# Altium schematic sheet PM12_ATxmega128.SchDoc: FIT_PM12 board
size 420 x 297 mm; CheckedBy: G.Kasprowicz; Author: INR Moscow; CompanyName: WUT ISE; DrawnBy: M.Podgórski; Organization: WUT ISE; Address1: PW ISE; Address2: Nowowiejska 15/19 00-665 Warsaw; Address3: gkasprow@gmail.com; DocumentNumber: 21; Revision: 2; SheetNumber: 5; SheetTotal: 34; ModifiedBy: -; CheckedDate: -; Title2: MCU; DivGrp: WUT ISE; Designer: INR RAS; ModifiedDate: -; ProjectName: Sensor Box
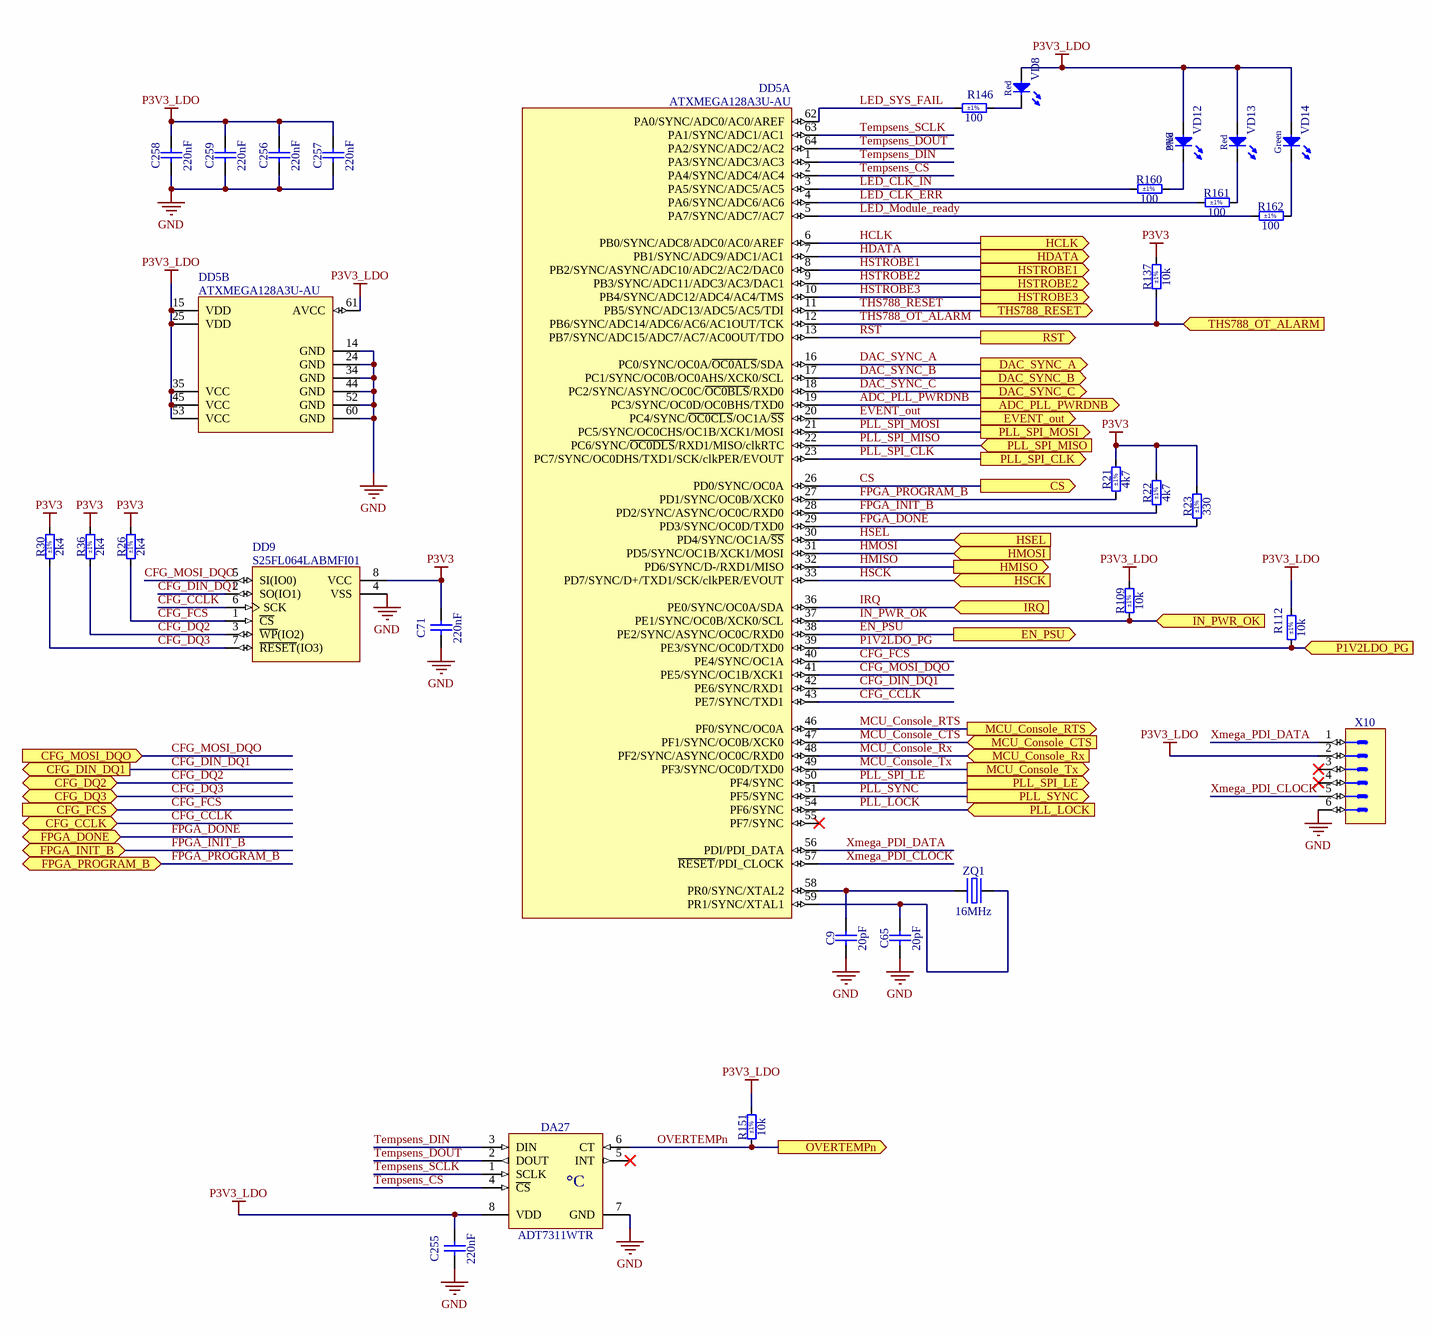
[diagram p0: PM12_ATxmega128.SchDoc]

## Parts
C9  20pF  [CAPC2012X135N]
C65  20pF  [CAPC2012X135N]
C71  220nF  [CAPC2012X135N]
C255  220nF  [CAPC2012X135N]
C256  220nF  [CAPC2012X135N]
C257  220nF  [CAPC2012X135N]
C258  220nF  [CAPC2012X135N]
C259  220nF  [CAPC2012X135N]
DA27  ADT7311WTR  [SOIC127P600X175-8N]
DD5  ATXMEGA128A3U-AU  [QFP80P1600X1600X120-64N]  (parts A,B of 2)
DD9  S25FL064LABMFI01  [SOIC127P800X216-8N]
R21  4k7  Tolerance: ±1%  [RESC2012X60N]
R22  4k7  Tolerance: ±1%  [RESC2012X60N]
R23  330  Tolerance: ±1%  [RESC2012X60N]
R26  2k4  Tolerance: ±1%  [RESC2012X60N]
R30  2k4  Tolerance: ±1%  [RESC2012X60N]
R36  2k4  Tolerance: ±1%  [RESC2012X60N]
R109  10k  Tolerance: ±1%  [RESC2012X60N]
R112  10k  Tolerance: ±1%  [RESC2012X60N]
R137  10k  Tolerance: ±1%  [RESC2012X60N]
R146  100  Tolerance: ±1%  [RESC2012X60N]
R151  10k  Tolerance: ±1%  [RESC2012X60N]
R160  100  Tolerance: ±1%  [RESC2012X60N]
R161  100  Tolerance: ±1%  [RESC2012X60N]
R162  100  Tolerance: ±1%  [RESC2012X60N]
VD8  Red  [LED_KINGBRIGHT_KPT-2012SURCK]
VD12  Blue  [LED_KINGBRIGHT_KPT-2012VBC-D]
VD13  Red  [LED_KINGBRIGHT_KPT-2012SURCK]
VD14  Green  [LED_KINGBRIGHT_KP-2012LSGC]
X10  (no value)  [CONNFLY_DS1013-06SSIB1-B-0]
ZQ1  16MHz  [XTAL_ABRACON_ABL]

## Ports
ADC_PLL_PWRDNB (out), CFG_CCLK (bidir), CFG_DIN_DQ1 (out), CFG_DQ2 (bidir), CFG_DQ3 (bidir), CFG_FCS (in), CFG_MOSI_DQO (in), CS (out), DAC_SYNC_A (out), DAC_SYNC_B (out), DAC_SYNC_C (out), EN_PSU (out), EVENT_out (out), FPGA_DONE (bidir), FPGA_INIT_B (bidir), FPGA_PROGRAM_B (bidir), HCLK (out), HDATA (out), HMISO (out), HMOSI (in), HSCK (in), HSEL (in), HSTROBE1 (out), HSTROBE2 (out), HSTROBE3 (out), IN_PWR_OK (in), IRQ (in), MCU_Console_CTS (in), MCU_Console_RTS (out), MCU_Console_Rx (in), MCU_Console_Tx (out), OVERTEMPn (out), P1V2LDO_PG (in), PLL_LOCK (in), PLL_SPI_CLK (out), PLL_SPI_LE (out), PLL_SPI_MISO (in), PLL_SPI_MOSI (out), PLL_SYNC (out), RST (out), THS788_OT_ALARM (in), THS788_RESET (out)

## Nets
GND: C9.1 C65.1 C71.1 C255.1 C256.1 C257.1 C258.1 C259.1 DA27.7(GND) DD5.14(GND) DD5.24(GND) DD5.34(GND) DD5.44(GND) DD5.52(GND) DD5.60(GND) DD9.4(VSS) X10.6
P3V3: C71.2 DD9.8(VCC) R21.2 R22.2 R23.2 R26.2 R30.2 R36.2 R137.2
P3V3_LDO: C255.2 C256.2 C257.2 C258.2 C259.2 DA27.8(VDD) DD5.15(VDD) DD5.25(VDD) DD5.35(VCC) DD5.45(VCC) DD5.53(VCC) DD5.61(AVCC) R109.2 R112.2 R151.2 VD8.2(A) VD12.2(A) VD13.2(A) VD14.2(A) X10.2
ADC_PLL_PWRDNB: DD5.19(PC3/SYNC/OC0D/OC0BHS/TXD0) ; port ADC_PLL_PWRDNB
CFG_CCLK: DD5.43(PE7/SYNC/TXD1) DD9.6(SCK) ; port CFG_CCLK
CFG_DIN_DQ1: DD5.42(PE6/SYNC/RXD1) DD9.2(SO(IO1)) ; port CFG_DIN_DQ1
CFG_DQ2: DD9.3(~{WP}(IO2)) R36.1 ; port CFG_DQ2
CFG_DQ3: DD9.7(~{RESET}(IO3)) R30.1 ; port CFG_DQ3
CFG_FCS: DD5.40(PE4/SYNC/OC1A) DD9.1(~{CS}) R26.1 ; port CFG_FCS
CFG_MOSI_DQO: DD5.41(PE5/SYNC/OC1B/XCK1) DD9.5(SI(IO0)) ; port CFG_MOSI_DQO
CS: DD5.26(PD0/SYNC/OC0A) ; port CS
DAC_SYNC_A: DD5.16(PC0/SYNC/OC0A/~{OC0ALS}/SDA) ; port DAC_SYNC_A
DAC_SYNC_B: DD5.17(PC1/SYNC/OC0B/OC0AHS/XCK0/SCL) ; port DAC_SYNC_B
DAC_SYNC_C: DD5.18(PC2/SYNC/ASYNC/OC0C/~{OC0BLS}/RXD0) ; port DAC_SYNC_C
EN_PSU: DD5.38(PE2/SYNC/ASYNC/OC0C/RXD0) ; port EN_PSU
EVENT_out: DD5.20(PC4/SYNC/~{OC0CLS}/OC1A/~{SS}) ; port EVENT_out
FPGA_DONE: DD5.29(PD3/SYNC/OC0D/TXD0) R23.1 ; port FPGA_DONE
FPGA_INIT_B: DD5.28(PD2/SYNC/ASYNC/OC0C/RXD0) R22.1 ; port FPGA_INIT_B
FPGA_PROGRAM_B: DD5.27(PD1/SYNC/OC0B/XCK0) R21.1 ; port FPGA_PROGRAM_B
HCLK: DD5.6(PB0/SYNC/ADC8/ADC0/AC0/AREF) ; port HCLK
HDATA: DD5.7(PB1/SYNC/ADC9/ADC1/AC1) ; port HDATA
HMISO: DD5.32(PD6/SYNC/D-/RXD1/MISO) ; port HMISO
HMOSI: DD5.31(PD5/SYNC/OC1B/XCK1/MOSI) ; port HMOSI
HSCK: DD5.33(PD7/SYNC/D+/TXD1/SCK/clkPER/EVOUT) ; port HSCK
HSEL: DD5.30(PD4/SYNC/OC1A/~{SS}) ; port HSEL
HSTROBE1: DD5.8(PB2/SYNC/ASYNC/ADC10/ADC2/AC2/DAC0) ; port HSTROBE1
HSTROBE2: DD5.9(PB3/SYNC/ADC11/ADC3/AC3/DAC1) ; port HSTROBE2
HSTROBE3: DD5.10(PB4/SYNC/ADC12/ADC4/AC4/TMS) ; port HSTROBE3
IN_PWR_OK: DD5.37(PE1/SYNC/OC0B/XCK0/SCL) R109.1 ; port IN_PWR_OK
IRQ: DD5.36(PE0/SYNC/OC0A/SDA) ; port IRQ
LED_CLK_ERR: DD5.4(PA6/SYNC/ADC6/AC6) R161.1
LED_CLK_IN: DD5.3(PA5/SYNC/ADC5/AC5) R160.1
LED_Module_ready: DD5.5(PA7/SYNC/ADC7/AC7) R162.1
LED_SYS_FAIL: DD5.62(PA0/SYNC/ADC0/AC0/AREF) R146.1
MCU_Console_CTS: DD5.47(PF1/SYNC/OC0B/XCK0) ; port MCU_Console_CTS
MCU_Console_RTS: DD5.46(PF0/SYNC/OC0A) ; port MCU_Console_RTS
MCU_Console_Rx: DD5.48(PF2/SYNC/ASYNC/OC0C/RXD0) ; port MCU_Console_Rx
MCU_Console_Tx: DD5.49(PF3/SYNC/OC0D/TXD0) ; port MCU_Console_Tx
OVERTEMPn: DA27.6(CT) R151.1 ; port OVERTEMPn
P1V2LDO_PG: DD5.39(PE3/SYNC/OC0D/TXD0) R112.1 ; port P1V2LDO_PG
PLL_LOCK: DD5.54(PF6/SYNC) ; port PLL_LOCK
PLL_SPI_CLK: DD5.23(PC7/SYNC/OC0DHS/TXD1/SCK/clkPER/EVOUT) ; port PLL_SPI_CLK
PLL_SPI_LE: DD5.50(PF4/SYNC) ; port PLL_SPI_LE
PLL_SPI_MISO: DD5.22(PC6/SYNC/~{OC0DLS}/RXD1/MISO/clkRTC) ; port PLL_SPI_MISO
PLL_SPI_MOSI: DD5.21(PC5/SYNC/OC0CHS/OC1B/XCK1/MOSI) ; port PLL_SPI_MOSI
PLL_SYNC: DD5.51(PF5/SYNC) ; port PLL_SYNC
RST: DD5.13(PB7/SYNC/ADC15/ADC7/AC7/AC0OUT/TDO) ; port RST
Tempsens_CS: DA27.4(~{CS}) DD5.2(PA4/SYNC/ADC4/AC4)
Tempsens_DIN: DA27.3(DIN) DD5.1(PA3/SYNC/ADC3/AC3)
Tempsens_DOUT: DA27.2(DOUT) DD5.64(PA2/SYNC/ADC2/AC2)
Tempsens_SCLK: DA27.1(SCLK) DD5.63(PA1/SYNC/ADC1/AC1)
THS788_OT_ALARM: DD5.12(PB6/SYNC/ADC14/ADC6/AC6/AC1OUT/TCK) R137.1 ; port THS788_OT_ALARM
THS788_RESET: DD5.11(PB5/SYNC/ADC13/ADC5/AC5/TDI) ; port THS788_RESET
Xmega_PDI_CLOCK: DD5.57(~{RESET}/PDI_CLOCK) X10.5
Xmega_PDI_DATA: DD5.56(PDI/PDI_DATA) X10.1
NetC9_2: C9.2 DD5.58(PR0/SYNC/XTAL2) ZQ1.1(OSC1)
NetC65_2: C65.2 DD5.59(PR1/SYNC/XTAL1) ZQ1.2(OSC2)
NetR146_2: R146.2 VD8.1(C)
NetR160_2: R160.2 VD12.1(C)
NetR161_2: R161.2 VD13.1(C)
NetR162_2: R162.2 VD14.1(C)

Not connected (* = marked no-connect by the designer): DA27 5(INT)*; DD5 55(PF7/SYNC)*; X10 3* 4*

## Notes on the sheet
- Project/Equipment
- Document
- Designer
- Drawn by
- Check.by
- Copyright WUT ISE 2024.
  This documentation describes Open Hardware and is licensed under the CERN OHL v.2. You may redistribute and modify this documentation under the terms of the CERN OHL v.2. (http://ohwr.org/CERNOHL). This documentation is distributed WITHOUT ANY EXPRESS OR IMPLIED WARRANTY, INCLUDING OF MERCHANTABILITY, SATISFACTORY QUALITY AND FITNESS FOR A PARTICULAR PURPOSE. Please see the CERN OHL v.2 for applicable conditions.
- Contact
- File
- Last Mod.
- Print Date
- Sheet
- Size
- A3
- of
- Rev
- (in symbol ADT7311WTR) °C

## Library data of the parts
C9 C65 = CC0805_20PF_50V_2%_C0G: Non-polarised capacitor; Part Description: SMD Multilayer Chip Ceramic Capacitor; Manufacturer: GENERIC; Manufacturer1 Part Number: CC0805GRNPO9BN200; Voltage: 50V; TC: C0G/NP0; Tolerance: ±2%; Part Number: CC0805_20PF_50V_2%_C0G; Component Kind: Standard; Component Type: Standard; Pin Count: 2; Value: 20pF; Status: None; Manufacturer Part Number: CC0805_20PF_50V_2%_C0G; Case: 0805; Mounted: Yes; Socket: No; SMD: Yes; Sense: No; Manufacturer1 Example: YAGEO PHYCOMP; Manufacturer1 ComponentHeight: 1.45mm; HelpURL: \\cern.ch\dfs\Applications\Altium\Datasheets\CC0805_NP0_YAGEO.pdf; Author: CERN DEM HF; CreateDate: 07.05.2024; LatestRevisionDate: 07.05.2024
C71 C255-C259 = CC0805_220NF_50V_10%_X7R: Non-polarised capacitor; Part Description: SMD Multilayer Chip Ceramic Capacitor; Manufacturer: GENERIC; Manufacturer1 Part Number: GRM21BR71H224KA01L; Voltage: 50V; TC: X7R; Tolerance: ±10%; Part Number: CC0805_220NF_50V_10%_X7R; Component Kind: Standard; Component Type: Standard; Pin Count: 2; Value: 220nF; Status: Preferred; Manufacturer Part Number: CC0805_220NF_50V_10%_X7R; Case: 0805; Mounted: Yes; Socket: No; SMD: Yes; Sense: No; Manufacturer1 Example: MURATA; Manufacturer1 ComponentHeight: 1.35mm; HelpURL: \\cern.ch\dfs\Applications\Altium\Datasheets\CC0805_X7R_MURATA.pdf; Author: CERN DEM JLC; CreateDate: 03.12.2007; LatestRevisionDate: 03.12.2007
DA27 = ADT7311WTR: ±0.5°C Accurate, 16-Bit Digital SPI Temperature Sensor; Manufacturer: ANALOG DEVICES; PressFit: No; Bonding: No; Part Number: ADT7311WTR; Component Kind: Standard; Component Type: Standard; Device: ADT7311WTR; PackageDescription: SOIC 8, Pitch 1.27mm - Body 4x5mm, IPC Medium Density; Part Description: ±0.5°C Accurate, 16-Bit Digital SPI Temperature Sensor; Manufacturer Part Number: ADT7311WTR; Pin Count: 8; Case: SOIC8; Mounted: Yes; Socket: No; SMD: Yes; Sense: No; ComponentHeight: 1.75mm; HelpURL: \\cern.ch\dfs\Applications\Altium\Datasheets\ADT7311WTR.pdf; Author: CERN DEM HF; CreateDate: 24.05.2024; LatestRevisionDate: 24.05.2024
DD5 = ATXMEGA128A3U-AU: 8/16-bit XMEGA A3BU 32MHz Microcontroller With 256KBytes of in-System Self-Programmable Flash; Part Description: 8/16-bit XMEGA A3U 32MHz Microcontroller with 128KBytes of in-System Self-Programmable Flash; Manufacturer: MICROCHIP TECHNOLOGY; PressFit: No; Bonding: No; Part Number: ATXMEGA128A3U-AU; Component Kind: Standard; Component Type: Standard; Device: ATXMEGA128A3U-AU; PackageDescription: QFP, 0.80mm Pitch, Square; 64 Pin, 14.00mm L X 14.00mm W X 1.20mm H body, IPC Medium Density; Manufacturer Part Number: ATXMEGA128A3U-AU; Pin Count: 64; Case: QFP64; Mounted: Yes; Socket: No; SMD: Yes; Sense: No; ComponentHeight: 1.2mm; HelpURL: \\cern.ch\dfs\Applications\Altium\Datasheets\ATXMEGA128A3U-AU.pdf; Author: CERN DEM HF; CreateDate: 24.05.2024; LatestRevisionDate: 24.05.2024
DD9 = S25FL064LABMFI01: 64 Mb (8 MB), 3V, FL-L SPI Flash Memory; Manufacturer: INFINEON; PressFit: No; Bonding: No; Part Number: S25FL064LABMFI01; Component Kind: Standard; Component Type: Standard; Device: S25FL064LABMFI01; PackageDescription: SOIC, 1.27mm Pitch; 8 Pin, 5.28mm W X 5.28mm L X 2.16mm H body, IPC Medium Density; Part Description: 64 Mb (8 MB), 3V, FL-L SPI Flash Memory; Manufacturer Part Number: S25FL064LABMFI01; Pin Count: 8; Case: SOIC8; Mounted: Yes; Socket: No; SMD: Yes; Sense: No; ComponentHeight: 2.16mm; HelpURL: \\cern.ch\dfs\Applications\Altium\Datasheets\S25FL064L.pdf; Author: CERN DEM HF; CreateDate: 06.06.2024; LatestRevisionDate: 06.06.2024
R21 R22 = R0805_4K7_1%_0.125W_100PPM: Resistor - 1%; Part Description: General Purpose Thick Film Chip Resistor; Manufacturer: GENERIC; Manufacturer1 Part Number: NRC10F4701TRF; Power: 0.125W; TC: ±100ppm/°C; PressFit: No; Part Number: R0805_4K7_1%_0.125W_100PPM; Component Kind: Standard; Component Type: Standard; Pin Count: 2; Value: 4k7; Status: Preferred; Manufacturer Part Number: R0805_4K7_1%_0.125W_100PPM; Case: 0805; Mounted: Yes; Sense: No; Socket: No; SMD: Yes; Manufacturer1 Example: NIC COMPONENT; Manufacturer1 ComponentHeight: 0.6mm; HelpURL: \\cern.ch\dfs\Applications\Altium\Datasheets\R0805_NIC_NRC.pdf; Author: CERN DEM JLC; CreateDate: 03.12.2007; LatestRevisionDate: 13.03.2008
R23 = R0805_330R_1%_0.125W_100PPM: Resistor - 1%; Part Description: General Purpose Thick Film Chip Resistor; Manufacturer: GENERIC; Manufacturer1 Part Number: NRC10F3300TRF; Power: 0.125W; TC: ±100ppm/°C; PressFit: No; Part Number: R0805_330R_1%_0.125W_100PPM; Component Kind: Standard; Component Type: Standard; Pin Count: 2; Value: 330; Status: Preferred; Manufacturer Part Number: R0805_330R_1%_0.125W_100PPM; Case: 0805; Mounted: Yes; Sense: No; Socket: No; SMD: Yes; Manufacturer1 Example: NIC COMPONENT; Manufacturer1 ComponentHeight: 0.6mm; HelpURL: \\cern.ch\dfs\Applications\Altium\Datasheets\R0805_NIC_NRC.pdf; Author: CERN DEM JLC; CreateDate: 03.12.2007; LatestRevisionDate: 13.03.2008
R26 R30 R36 = R0805_2K4_1%_0.125W_100PPM: Resistor - 1%; Part Description: General Purpose Thick Film Chip Resistor; Manufacturer: GENERIC; Manufacturer1 Part Number: NRC10F2401TRF; Power: 0.125W; TC: ±100ppm/°C; PressFit: No; Part Number: R0805_2K4_1%_0.125W_100PPM; Component Kind: Standard; Component Type: Standard; Pin Count: 2; Value: 2k4; Status: Preferred; Manufacturer Part Number: R0805_2K4_1%_0.125W_100PPM; Case: 0805; Mounted: Yes; Sense: No; Socket: No; SMD: Yes; Manufacturer1 Example: NIC COMPONENT; Manufacturer1 ComponentHeight: 0.6mm; HelpURL: \\cern.ch\dfs\Applications\Altium\Datasheets\R0805_NIC_NRC.pdf; Author: CERN DEM JLC; CreateDate: 03.12.2007; LatestRevisionDate: 13.03.2008
R109 R112 R137 R151 = R0805_10K_1%_0.125W_100PPM: Resistor - 1%; Part Description: General Purpose Thick Film Chip Resistor; Manufacturer: GENERIC; Manufacturer1 Part Number: NRC10F1002TRF; Power: 0.125W; TC: ±100ppm/°C; PressFit: No; Part Number: R0805_10K_1%_0.125W_100PPM; Component Kind: Standard; Component Type: Standard; Pin Count: 2; Value: 10k; Status: Preferred; Manufacturer Part Number: R0805_10K_1%_0.125W_100PPM; Case: 0805; Mounted: Yes; Sense: No; Socket: No; SMD: Yes; Manufacturer1 Example: NIC COMPONENT; Manufacturer1 ComponentHeight: 0.6mm; HelpURL: \\cern.ch\dfs\Applications\Altium\Datasheets\R0805_NIC_NRC.pdf; Author: CERN DEM JLC; CreateDate: 03.12.2007; LatestRevisionDate: 13.03.2008
R146 R160-R162 = R0805_100R_1%_0.125W_100PPM: Resistor - 1%; Part Description: General Purpose Thick Film Chip Resistor; Manufacturer: GENERIC; Manufacturer1 Part Number: NRC10F4700TRF; Power: 0.125W; TC: ±100ppm/°C; PressFit: No; Part Number: R0805_100R_1%_0.125W_100PPM; Component Kind: Standard; Component Type: Standard; Pin Count: 2; Value: 100; Status: Preferred; Manufacturer Part Number: R0805_100R_1%_0.125W_100PPM; Case: 0805; Mounted: Yes; Sense: No; Socket: No; SMD: Yes; Manufacturer1 Example: NIC COMPONENT; Manufacturer1 ComponentHeight: 0.6mm; HelpURL: \\cern.ch\dfs\Applications\Altium\Datasheets\R0805_NIC_NRC.pdf; Author: CERN DEM JLC; CreateDate: 03.12.2007; LatestRevisionDate: 13.03.2008
VD8 VD13 = LED_KINGBRIGHT_KPT-2012SURCK: LED Red 1C 2A; Part Description: 2.0X1.25mm, SMD Hyper Red Chip LED Lamp, KPT-2012 Series; PressFit: No; Bonding: No; Part Number: LED_KINGBRIGHT_KPT-2012SURCK; Component Kind: Standard; Component Type: Standard; Color: Red; PackageDescription: SMT Hyper Red LED, Case 2012, Body L 2.00mm X  W 1.25mm X H 0.75mm; Manufacturer: KINGBRIGHT; Manufacturer Part Number: KPT-2012SURCK; Pin Count: 2; Case: 0805; Mounted: Yes; Socket: No; SMD: Yes; Sense: No; ComponentHeight: 0.75mm; HelpURL: \\cern.ch\dfs\Applications\Altium\Datasheets\LED_KINGBRIGHT_KPT-2012SURCK.pdf; Author: CERN DEM BC; CreateDate: 06.11.2020; LatestRevisionDate: 06.11.2020
VD12 = LED_KINGBRIGHT_KPT-2012VBC-D: LED Blue 1C 2A; Part Description: 2.0X1.25mm, SMD Blue Chip LED Lamp, KPT-2012 Series; PressFit: No; Bonding: No; Part Number: LED_KINGBRIGHT_KPT-2012VBC-D; Component Kind: Standard; Component Type: Standard; Color: Blue; PackageDescription: SMT Blue LED, Case 2012, Body L 2.00mm X  W 1.25mm X H 0.75mm; Manufacturer: KINGBRIGHT; Manufacturer Part Number: KPT-2012VBC-D; Pin Count: 2; Case: 0805; Mounted: Yes; Socket: No; SMD: Yes; Sense: No; ComponentHeight: 0.75mm; HelpURL: \\cern.ch\dfs\Applications\Altium\Datasheets\LED_KINGBRIGHT_KPT-2012VBC-D.pdf; Author: CERN DEM BC; CreateDate: 27.01.2021; LatestRevisionDate: 27.01.2021
VD14 = LED_KINGBRIGHT_KP-2012LSGC: LED Green 1C 2A; Part Description: 2.0x1.2mm Surface Mount Green LED; PressFit: No; Bonding: No; Part Number: LED_KINGBRIGHT_KP-2012LSGC; Component Kind: Standard; Component Type: Standard; Color: Green; PackageDescription: 2.0x1.2mm Surface Mount Green LED; Manufacturer: KINGBRIGHT; Manufacturer Part Number: KP-2012LSGC; Pin Count: 2; Case: 0805; Mounted: Yes; Socket: No; SMD: Yes; Sense: No; ComponentHeight: 1.1mm; HelpURL: \\cern.ch\dfs\Applications\Altium\Datasheets\LED_KINGBRIGHT_KP-2012LSGC.pdf; Author: CERN DEM BC; CreateDate: 09.11.2020; LatestRevisionDate: 09.11.2020
X10 = CONNFLY_DS1013-06SSIB1-B-0: Connector 6 Male; Part Description: 6 Contacts, 2.54mm Box Header V/T,R/A & SMT Type; PressFit: No; Part Number: CONNFLY_DS1013-06SSIB1-B-0; Component Kind: Standard; Component Type: Standard; Pin Count: 6; Mounted: Yes; Socket: No; SMD: No; Sense: No; Status: None; Manufacturer: CONNFLY; Manufacturer Part Number: DS1013-06SSIB1-B-0; ComponentHeight: 9.1mm; HelpURL: \\cern.ch\dfs\Applications\Altium\Datasheets\CONNFLY_DS1013.pdf; Author: CERN DEM HF; CreateDate: 30.05.2024; LatestRevisionDate: 30.05.2024
ZQ1 = XTAL_16MHZ_ABRACON_ABL-16.000MHZ-B1U: Quartz Crystal; Part Description: Tolerance: ±10ppm, Stability: ±10ppm, -20°C to +70°C, 18pF, 40 Ohms ESR, Through Mount Microprocessor Crystal, ABL Series; PressFit: No; Bonding: No; Part Number: XTAL_16MHZ_ABRACON_ABL-16.000MHZ-B1U; Component Kind: Standard; Component Type: Standard; PackageDescription: THD Crystal, Body 11.5mm L X 5.00mm W X 3.50mm H, ALB Series; Value: 16MHz; Manufacturer: ABRACON; Manufacturer Part Number: ABL-16.000MHZ-B1U; Pin Count: 2; Mounted: Yes; Socket: No; SMD: No; Sense: No; ComponentHeight: 3.5mm; HelpURL: \\cern.ch\dfs\Applications\Altium\Datasheets\XTAL_ABRACON_ABL.pdf; Author: CERN DEM HF; CreateDate: 04.06.2024; LatestRevisionDate: 04.06.2024